# EAGLE design 2layer_v2 (EAGLE 9.4.1)
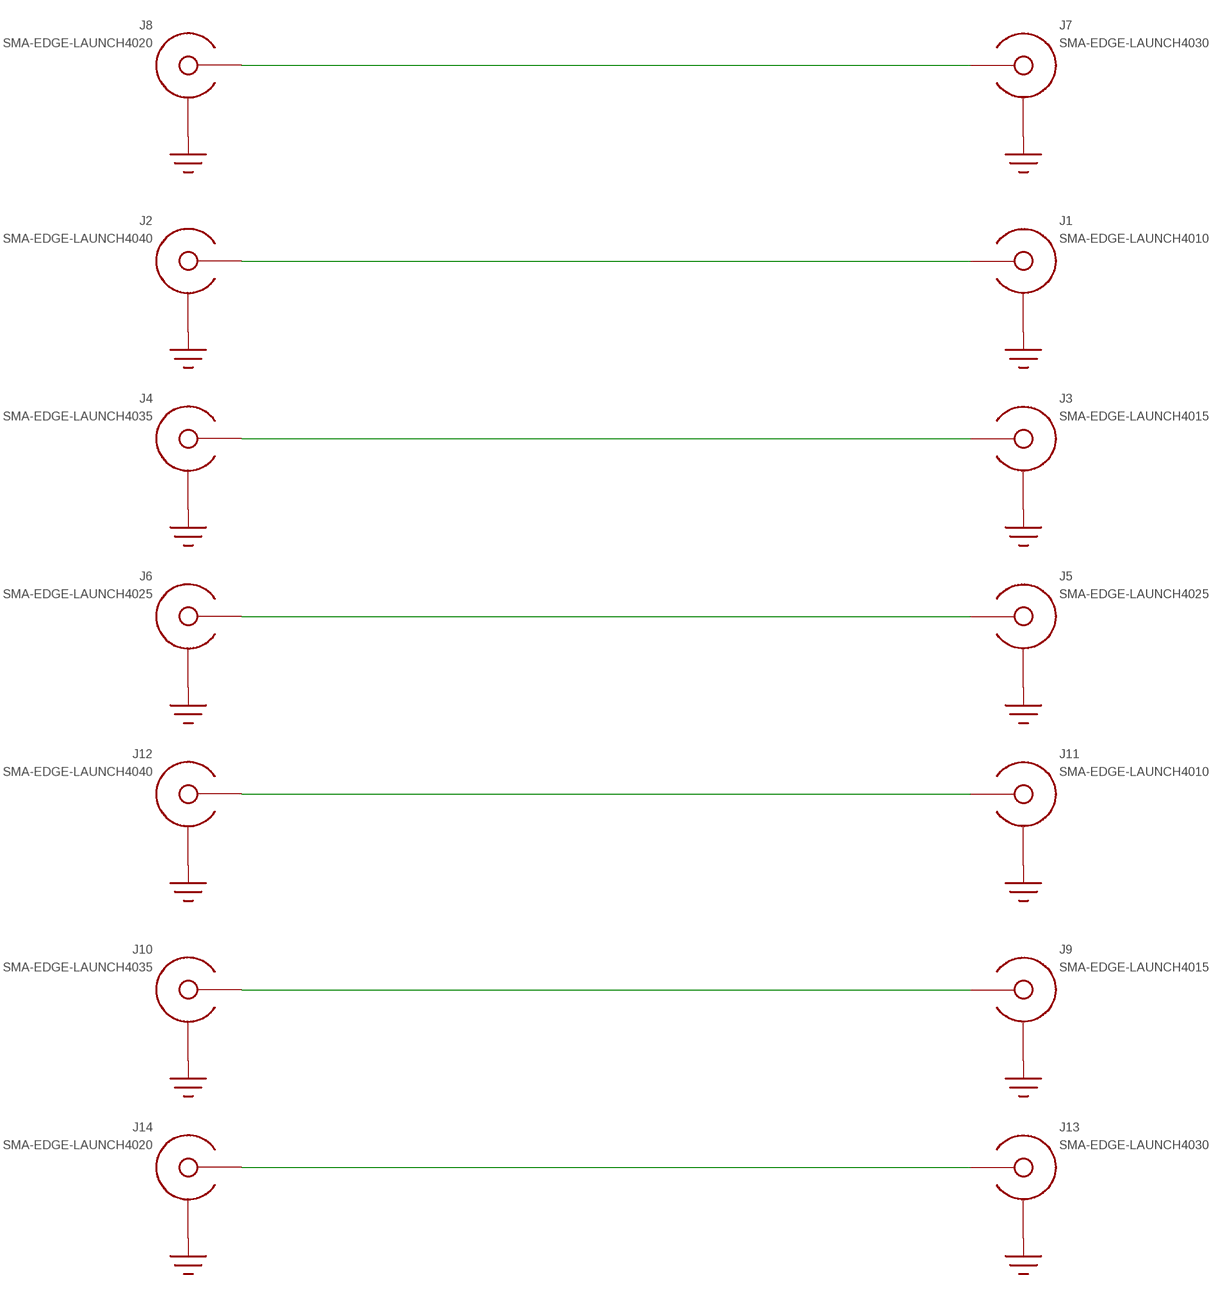
[diagram p0: schematic, sheet 1]

## Parts
J1  SMA-EDGE-LAUNCH4010  [SMA_EDGE_LAUNCH_2L_4010]
J2  SMA-EDGE-LAUNCH4040  [SMA_EDGE_LAUNCH_2L_4040]
J3  SMA-EDGE-LAUNCH4015  [SMA_EDGE_LAUNCH_2L_4015]
J4  SMA-EDGE-LAUNCH4035  [SMA_EDGE_LAUNCH_2L_4035]
J5  SMA-EDGE-LAUNCH4025  [SMA_EDGE_LAUNCH_2L_4025]
J6  SMA-EDGE-LAUNCH4025  [SMA_EDGE_LAUNCH_2L_4025]
J7  SMA-EDGE-LAUNCH4030  [SMA_EDGE_LAUNCH_2L_4030]
J8  SMA-EDGE-LAUNCH4020  [SMA_EDGE_LAUNCH_2L_4020]
J9  SMA-EDGE-LAUNCH4015  [SMA_EDGE_LAUNCH_2L_4015]
J10  SMA-EDGE-LAUNCH4035  [SMA_EDGE_LAUNCH_2L_4035]
J11  SMA-EDGE-LAUNCH4010  [SMA_EDGE_LAUNCH_2L_4010]
J12  SMA-EDGE-LAUNCH4040  [SMA_EDGE_LAUNCH_2L_4040]
J13  SMA-EDGE-LAUNCH4030  [SMA_EDGE_LAUNCH_2L_4030]
J14  SMA-EDGE-LAUNCH4020  [SMA_EDGE_LAUNCH_2L_4020]

## Nets
GND: J1.BOTTOM_GND(SHIELD) J1.GND@1(SHIELD) J1.GND@2(SHIELD) J1.GND@3(SHIELD) J1.GND@4(SHIELD) J1.GND@5(SHIELD) J1.GND@6(SHIELD) J1.GND@7(SHIELD) J1.GND@8(SHIELD) J1.GND@11(SHIELD) J1.GND@12(SHIELD) J1.GND@14(SHIELD) J1.GND@15(SHIELD) J1.GND@16(SHIELD) J1.GND@17(SHIELD) J1.GND_PAD1(SHIELD) J1.GND_PAD2(SHIELD) J2.BOTTOM_GND(SHIELD) J2.GND@1(SHIELD) J2.GND@2(SHIELD) J2.GND@3(SHIELD) J2.GND@4(SHIELD) J2.GND@5(SHIELD) J2.GND@6(SHIELD) J2.GND@7(SHIELD) J2.GND@8(SHIELD) J2.GND@11(SHIELD) J2.GND@12(SHIELD) J2.GND@14(SHIELD) J2.GND@15(SHIELD) J2.GND@16(SHIELD) J2.GND@17(SHIELD) J2.GND_PAD1(SHIELD) J2.GND_PAD2(SHIELD) J3.BOTTOM_GND(SHIELD) J3.GND@1(SHIELD) J3.GND@2(SHIELD) J3.GND@3(SHIELD) J3.GND@4(SHIELD) J3.GND@5(SHIELD) J3.GND@6(SHIELD) J3.GND@7(SHIELD) J3.GND@8(SHIELD) J3.GND@11(SHIELD) J3.GND@12(SHIELD) J3.GND@14(SHIELD) J3.GND@15(SHIELD) J3.GND@16(SHIELD) J3.GND@17(SHIELD) J3.GND_PAD1(SHIELD) J3.GND_PAD2(SHIELD) J4.BOTTOM_GND(SHIELD) J4.GND@1(SHIELD) J4.GND@2(SHIELD) J4.GND@3(SHIELD) J4.GND@4(SHIELD) J4.GND@5(SHIELD) J4.GND@6(SHIELD) J4.GND@7(SHIELD) J4.GND@8(SHIELD) J4.GND@11(SHIELD) J4.GND@12(SHIELD) J4.GND@14(SHIELD) J4.GND@15(SHIELD) J4.GND@16(SHIELD) J4.GND@17(SHIELD) J4.GND_PAD1(SHIELD) J4.GND_PAD2(SHIELD) J5.BOTTOM_GND(SHIELD) J5.GND@1(SHIELD) J5.GND@2(SHIELD) J5.GND@3(SHIELD) J5.GND@4(SHIELD) J5.GND@5(SHIELD) J5.GND@6(SHIELD) J5.GND@7(SHIELD) J5.GND@8(SHIELD) J5.GND@11(SHIELD) J5.GND@12(SHIELD) J5.GND@14(SHIELD) J5.GND@15(SHIELD) J5.GND@16(SHIELD) J5.GND@17(SHIELD) J5.GND_PAD1(SHIELD) J5.GND_PAD2(SHIELD) J6.BOTTOM_GND(SHIELD) J6.GND@1(SHIELD) J6.GND@2(SHIELD) J6.GND@3(SHIELD) J6.GND@4(SHIELD) J6.GND@5(SHIELD) J6.GND@6(SHIELD) J6.GND@7(SHIELD) J6.GND@8(SHIELD) J6.GND@11(SHIELD) J6.GND@12(SHIELD) J6.GND@14(SHIELD) J6.GND@15(SHIELD) J6.GND@16(SHIELD) J6.GND@17(SHIELD) J6.GND_PAD1(SHIELD) J6.GND_PAD2(SHIELD) J7.BOTTOM_GND(SHIELD) J7.GND@1(SHIELD) J7.GND@2(SHIELD) J7.GND@3(SHIELD) J7.GND@4(SHIELD) J7.GND@5(SHIELD) J7.GND@6(SHIELD) J7.GND@7(SHIELD) J7.GND@8(SHIELD) J7.GND@11(SHIELD) J7.GND@12(SHIELD) J7.GND@14(SHIELD) J7.GND@15(SHIELD) J7.GND@16(SHIELD) J7.GND@17(SHIELD) J7.GND_PAD1(SHIELD) J7.GND_PAD2(SHIELD) J8.BOTTOM_GND(SHIELD) J8.GND@1(SHIELD) J8.GND@2(SHIELD) J8.GND@3(SHIELD) J8.GND@4(SHIELD) J8.GND@5(SHIELD) J8.GND@6(SHIELD) J8.GND@7(SHIELD) J8.GND@8(SHIELD) J8.GND@11(SHIELD) J8.GND@12(SHIELD) J8.GND@14(SHIELD) J8.GND@15(SHIELD) J8.GND@16(SHIELD) J8.GND@17(SHIELD) J8.GND_PAD1(SHIELD) J8.GND_PAD2(SHIELD) J9.BOTTOM_GND(SHIELD) J9.GND@1(SHIELD) J9.GND@2(SHIELD) J9.GND@3(SHIELD) J9.GND@4(SHIELD) J9.GND@5(SHIELD) J9.GND@6(SHIELD) J9.GND@7(SHIELD) J9.GND@8(SHIELD) J9.GND@11(SHIELD) J9.GND@12(SHIELD) J9.GND@14(SHIELD) J9.GND@15(SHIELD) J9.GND@16(SHIELD) J9.GND@17(SHIELD) J9.GND_PAD1(SHIELD) J9.GND_PAD2(SHIELD) J10.BOTTOM_GND(SHIELD) J10.GND@1(SHIELD) J10.GND@2(SHIELD) J10.GND@3(SHIELD) J10.GND@4(SHIELD) J10.GND@5(SHIELD) J10.GND@6(SHIELD) J10.GND@7(SHIELD) J10.GND@8(SHIELD) J10.GND@11(SHIELD) J10.GND@12(SHIELD) J10.GND@14(SHIELD) J10.GND@15(SHIELD) J10.GND@16(SHIELD) J10.GND@17(SHIELD) J10.GND_PAD1(SHIELD) J10.GND_PAD2(SHIELD) J11.BOTTOM_GND(SHIELD) J11.GND@1(SHIELD) J11.GND@2(SHIELD) J11.GND@3(SHIELD) J11.GND@4(SHIELD) J11.GND@5(SHIELD) J11.GND@6(SHIELD) J11.GND@7(SHIELD) J11.GND@8(SHIELD) J11.GND@11(SHIELD) J11.GND@12(SHIELD) J11.GND@14(SHIELD) J11.GND@15(SHIELD) J11.GND@16(SHIELD) J11.GND@17(SHIELD) J11.GND_PAD1(SHIELD) J11.GND_PAD2(SHIELD) J12.BOTTOM_GND(SHIELD) J12.GND@1(SHIELD) J12.GND@2(SHIELD) J12.GND@3(SHIELD) J12.GND@4(SHIELD) J12.GND@5(SHIELD) J12.GND@6(SHIELD) J12.GND@7(SHIELD) J12.GND@8(SHIELD) J12.GND@11(SHIELD) J12.GND@12(SHIELD) J12.GND@14(SHIELD) J12.GND@15(SHIELD) J12.GND@16(SHIELD) J12.GND@17(SHIELD) J12.GND_PAD1(SHIELD) J12.GND_PAD2(SHIELD) J13.BOTTOM_GND(SHIELD) J13.GND@1(SHIELD) J13.GND@2(SHIELD) J13.GND@3(SHIELD) J13.GND@4(SHIELD) J13.GND@5(SHIELD) J13.GND@6(SHIELD) J13.GND@7(SHIELD) J13.GND@8(SHIELD) J13.GND@11(SHIELD) J13.GND@12(SHIELD) J13.GND@14(SHIELD) J13.GND@15(SHIELD) J13.GND@16(SHIELD) J13.GND@17(SHIELD) J13.GND_PAD1(SHIELD) J13.GND_PAD2(SHIELD) J14.BOTTOM_GND(SHIELD) J14.GND@1(SHIELD) J14.GND@2(SHIELD) J14.GND@3(SHIELD) J14.GND@4(SHIELD) J14.GND@5(SHIELD) J14.GND@6(SHIELD) J14.GND@7(SHIELD) J14.GND@8(SHIELD) J14.GND@11(SHIELD) J14.GND@12(SHIELD) J14.GND@14(SHIELD) J14.GND@15(SHIELD) J14.GND@16(SHIELD) J14.GND@17(SHIELD) J14.GND_PAD1(SHIELD) J14.GND_PAD2(SHIELD)
N$1 [27-6]: J1.CENTER@1(CENTER) J2.CENTER@1(CENTER)
N$2 [28-6]: J3.CENTER@1(CENTER) J4.CENTER@1(CENTER)
N$3 [30-6]: J5.CENTER@1(CENTER) J6.CENTER@1(CENTER)
N$4 [31-6]: J7.CENTER@1(CENTER) J8.CENTER@1(CENTER)
N$5 [32-6]: J9.CENTER@1(CENTER) J10.CENTER@1(CENTER)
N$6 [33-6]: J11.CENTER@1(CENTER) J12.CENTER@1(CENTER)
N$7 [29-6]: J13.CENTER@1(CENTER) J14.CENTER@1(CENTER)

## Library data of the parts
J1-J14 = sma_footprint_2l:SMA-EDGE-LAUNCH

## Net classes
1 33-6: width 0.838 mm, clearance 0.152 mm
2 32-6: width 0.813 mm, clearance 0.152 mm
3 31-6: width 0.787 mm, clearance 0.152 mm
4 30-6: width 0.762 mm, clearance 0.152 mm
5 29-6: width 0.737 mm, clearance 0.152 mm
6 28-6: width 0.711 mm, clearance 0.152 mm
7 27-6: width 0.686 mm, clearance 0.152 mm

## Board
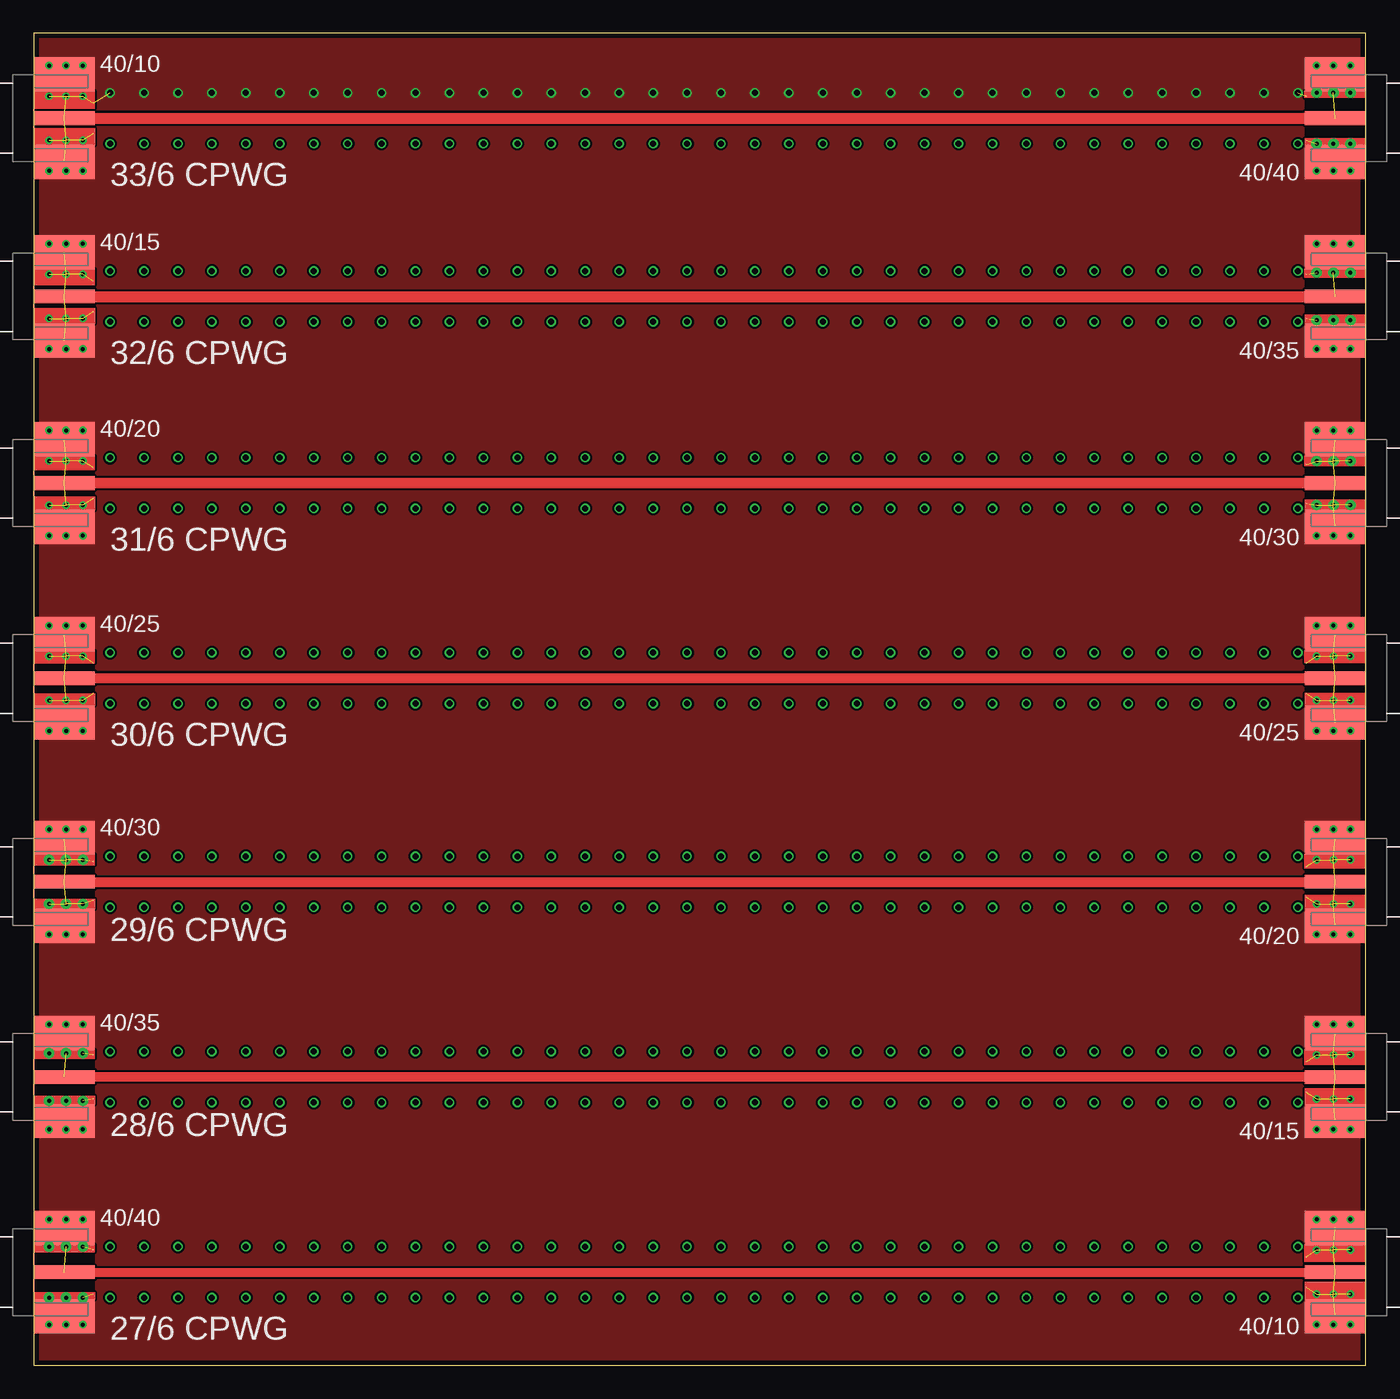
[diagram p1: board, top side]
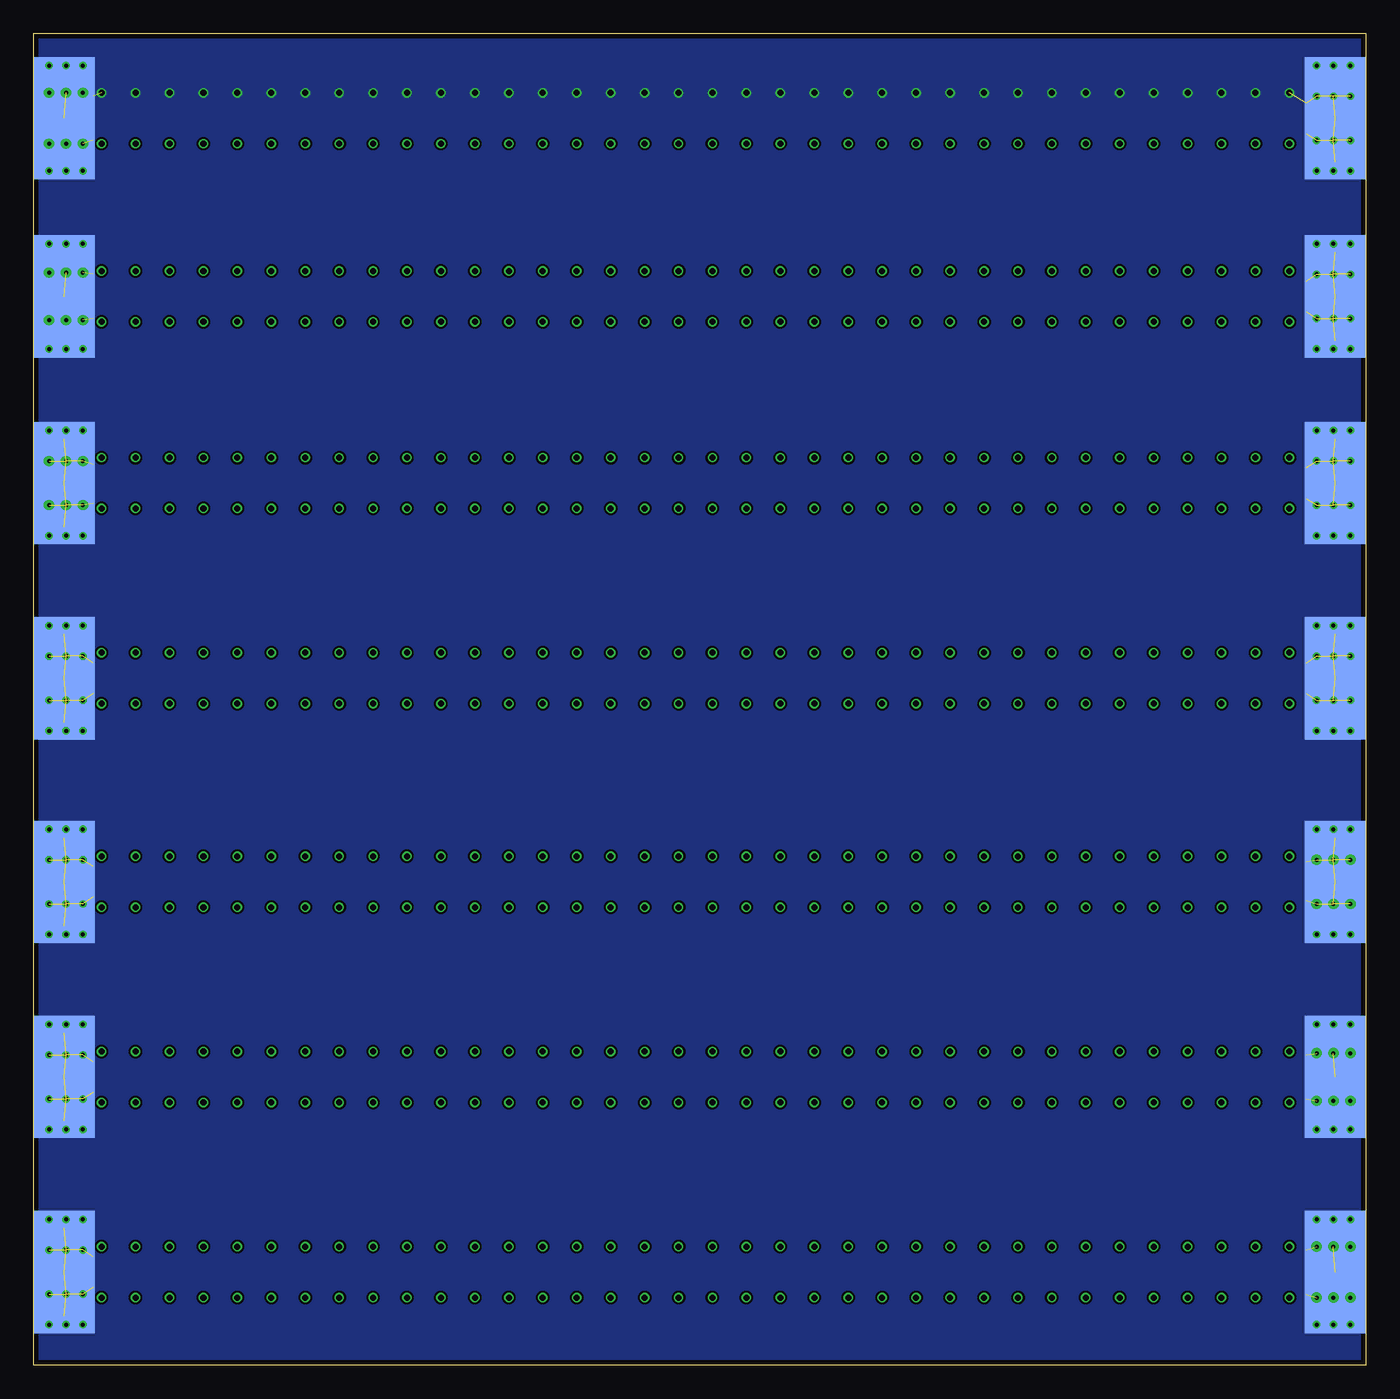
[diagram p2: board, bottom side, seen from below]

Size 99.69 x 99.69 mm. Coordinates in mm from the lower left corner, seen from the top.
Outline: 0,0 99.69,0 99.69,99.69 0,99.69 0,0
Copper layers (1*16): Top 0.035559375mm / dielectric 1.6mm / Bottom 0.035559375mm
Design rules "oshpark-2layer *": minimum track width 6mil, minimum drill 10mil, track to track 6mil, track to pad 6mil, pad to pad 6mil, via to via 6mil, smd to smd 6mil, copper to edge 15mil, drill to drill 6mil, minimum pad ring 5mil, minimum via ring 5mil, stop-mask expansion 2.5mil, vias tented up to drill 20mil, thermal gap 10mil

### Footprints (pad centres in the part's own frame; a part is rotated, then mirrored left to right if it is on the bottom)
SMA_EDGE_LAUNCH_2L_4010 = smd 4.572 x 9.144 bottom: BOTTOM_GND 2.286,0 | smd 4.572 x 1.016: CENTER@1 2.286,0 | drill 0.3: GND@1 1.143,3.937; GND@2 3.683,3.937; GND@3 1.143,1.651; GND@4 3.683,1.651; GND@5 1.143,-1.651; GND@6 3.683,-1.651; GND@7 1.143,-3.937; GND@8 3.683,-3.937; GND@14 2.413,3.937; GND@15 2.413,-3.937; GND@16 2.413,-1.651; GND@17 2.413,1.651 | smd 0.051 x 0.051: GND@11 4.445,1.143; GND@12 4.445,-1.143 | smd 4.572 x 2.54: GND_PAD1 2.286,3.302; GND_PAD2 2.286,-3.302
SMA_EDGE_LAUNCH_2L_4040 = smd 4.572 x 9.144 bottom: BOTTOM_GND 2.286,0 | smd 4.572 x 1.016: CENTER@1 2.286,0 | drill 0.3: GND@1 1.143,3.937; GND@2 3.683,3.937; GND@7 1.143,-3.937; GND@8 3.683,-3.937; GND@14 2.413,3.937; GND@15 2.413,-3.937 | drill 0.3 pad 0.762: GND@3 1.143,1.905; GND@4 3.683,1.905; GND@5 1.143,-1.905; GND@6 3.683,-1.905; GND@16 2.413,-1.905; GND@17 2.413,1.905 | smd 0.051 x 0.051: GND@11 4.445,1.651; GND@12 4.445,-1.651 | smd 4.572 x 2.54: GND_PAD1 2.286,3.302; GND_PAD2 2.286,-3.302
SMA_EDGE_LAUNCH_2L_4015 = smd 4.572 x 9.144 bottom: BOTTOM_GND 2.286,0 | smd 4.572 x 1.016: CENTER@1 2.286,0 | drill 0.3: GND@1 1.143,3.937; GND@2 3.683,3.937; GND@3 1.143,1.651; GND@4 3.683,1.651; GND@5 1.143,-1.651; GND@6 3.683,-1.651; GND@7 1.143,-3.937; GND@8 3.683,-3.937; GND@14 2.413,3.937; GND@15 2.413,-3.937; GND@16 2.413,-1.651; GND@17 2.413,1.651 | smd 0.051 x 0.051: GND@11 4.445,1.143; GND@12 4.445,-1.143 | smd 4.572 x 2.54: GND_PAD1 2.286,3.302; GND_PAD2 2.286,-3.302
SMA_EDGE_LAUNCH_2L_4035 = smd 4.572 x 9.144 bottom: BOTTOM_GND 2.286,0 | smd 4.572 x 1.016: CENTER@1 2.286,0 | drill 0.3: GND@1 1.143,3.937; GND@2 3.683,3.937; GND@7 1.143,-3.937; GND@8 3.683,-3.937; GND@14 2.413,3.937; GND@15 2.413,-3.937 | drill 0.3 pad 0.762: GND@3 1.143,1.778; GND@4 3.683,1.778; GND@5 1.143,-1.778; GND@6 3.683,-1.778; GND@16 2.413,-1.778; GND@17 2.413,1.778 | smd 0.051 x 0.051: GND@11 4.445,1.651; GND@12 4.445,-1.651 | smd 4.572 x 2.54: GND_PAD1 2.286,3.302; GND_PAD2 2.286,-3.302
SMA_EDGE_LAUNCH_2L_4025 = smd 4.572 x 9.144 bottom: BOTTOM_GND 2.286,0 | smd 4.572 x 1.016: CENTER@1 2.286,0 | drill 0.3: GND@1 1.143,3.937; GND@2 3.683,3.937; GND@3 1.143,1.651; GND@4 3.683,1.651; GND@5 1.143,-1.651; GND@6 3.683,-1.651; GND@7 1.143,-3.937; GND@8 3.683,-3.937; GND@14 2.413,3.937; GND@15 2.413,-3.937; GND@16 2.413,-1.651; GND@17 2.413,1.651 | smd 0.051 x 0.051: GND@11 4.445,1.143; GND@12 4.445,-1.143 | smd 4.572 x 2.54: GND_PAD1 2.286,3.302; GND_PAD2 2.286,-3.302
SMA_EDGE_LAUNCH_2L_4030 = smd 4.572 x 9.144 bottom: BOTTOM_GND 2.286,0 | smd 4.572 x 1.016: CENTER@1 2.286,0 | drill 0.3: GND@1 1.143,3.937; GND@2 3.683,3.937; GND@7 1.143,-3.937; GND@8 3.683,-3.937; GND@14 2.413,3.937; GND@15 2.413,-3.937 | drill 0.3 pad 0.762: GND@3 1.143,1.651; GND@4 3.683,1.651; GND@5 1.143,-1.651; GND@6 3.683,-1.651; GND@16 2.413,-1.651; GND@17 2.413,1.651 | smd 0.051 x 0.051: GND@11 4.445,1.524; GND@12 4.445,-1.397 | smd 4.572 x 2.54: GND_PAD1 2.286,3.302; GND_PAD2 2.286,-3.302
SMA_EDGE_LAUNCH_2L_4020 = smd 4.572 x 9.144 bottom: BOTTOM_GND 2.286,0 | smd 4.572 x 1.016: CENTER@1 2.286,0 | drill 0.3: GND@1 1.143,3.937; GND@2 3.683,3.937; GND@3 1.143,1.651; GND@4 3.683,1.651; GND@5 1.143,-1.651; GND@6 3.683,-1.651; GND@7 1.143,-3.937; GND@8 3.683,-3.937; GND@14 2.413,3.937; GND@15 2.413,-3.937; GND@16 2.413,-1.651; GND@17 2.413,1.651 | smd 0.051 x 0.051: GND@11 4.445,1.143; GND@12 4.445,-1.143 | smd 4.572 x 2.54: GND_PAD1 2.286,3.302; GND_PAD2 2.286,-3.302

### Placement (x,y rotation side)
J1  99.69,6.99 180 top
J2  0,6.99 0 top
J3  99.69,21.59 180 top
J4  0,21.59 0 top
J5  99.69,51.44 180 top
J6  0,51.44 0 top
J7  99.69,66.04 180 top
J8  0,66.04 0 top
J9  0,80.01 0 top
J10  99.69,80.01 180 top
J11  0,93.34 0 top
J12  99.69,93.34 180 top
J13  0,36.2 0 top
J14  99.69,36.2 180 top

### Tracks (layer width: path | path; a pad name or v marks a point on that pad's centre or on a via)
GND  (via drill 0.45)  (109 unrouted)
  other vias: 5.71,95.25 8.26,95.25 10.79,95.25 13.34,95.25 15.88,95.25 18.41,95.25 20.95,95.25 23.5,95.25 26.04,95.25 28.57,95.25 31.11,95.25 33.66,95.25 36.2,95.25 38.73,95.25 41.27,95.25 43.81,95.25 46.35,95.25 48.9,95.25 51.44,95.25 53.98,95.25 56.52,95.25 59.05,95.25 61.59,95.25 64.14,95.25 66.67,95.25 69.22,95.25 71.75,95.25 74.3,95.25 76.83,95.25 79.38,95.25 81.92,95.25 84.45,95.25 87,95.25 89.53,95.25 92.08,95.25 94.61,95.25
  pour Top (no thermals): 0,0 99.69,0 99.69,99.69 0,99.69
  pour Bottom (no thermals): 0,0 99.69,0 99.69,99.69 0,99.69
GND1  (via drill 0.45)
  other vias: 5.71,91.44 8.26,91.44 10.79,91.44 13.34,91.44 15.88,91.44 18.41,91.44 20.95,91.44 23.5,91.44 26.04,91.44 28.57,91.44 31.11,91.44 33.66,91.44 36.2,91.44 38.73,91.44 41.27,91.44 43.81,91.44 46.35,91.44 48.9,91.44 51.44,91.44 53.98,91.44 56.52,91.44 59.05,91.44 61.59,91.44 64.14,91.44 66.67,91.44 69.22,91.44 71.75,91.44 74.3,91.44 76.83,91.44 79.38,91.44 81.92,91.44 84.45,91.44 87,91.44 89.53,91.44 92.08,91.44 94.61,91.44
GND2  (via drill 0.45)
  other vias: 5.71,81.92 8.26,81.92 10.79,81.92 13.34,81.92 15.88,81.92 18.41,81.92 20.95,81.92 23.5,81.92 26.04,81.92 28.57,81.92 31.11,81.92 33.66,81.92 36.2,81.92 38.73,81.92 41.27,81.92 43.81,81.92 46.35,81.92 48.9,81.92 51.44,81.92 53.98,81.92 56.52,81.92 59.05,81.92 61.59,81.92 64.14,81.92 66.67,81.92 69.22,81.92 71.75,81.92 74.3,81.92 76.83,81.92 79.38,81.92 81.92,81.92 84.45,81.92 87,81.92 89.53,81.92 92.08,81.92 94.61,81.92
GND3  (via drill 0.45)
  other vias: 5.71,78.11 8.26,78.11 10.79,78.11 13.34,78.11 15.88,78.11 18.41,78.11 20.95,78.11 23.5,78.11 26.04,78.11 28.57,78.11 31.11,78.11 33.66,78.11 36.2,78.11 38.73,78.11 41.27,78.11 43.81,78.11 46.35,78.11 48.9,78.11 51.44,78.11 53.98,78.11 56.52,78.11 59.05,78.11 61.59,78.11 64.14,78.11 66.67,78.11 69.22,78.11 71.75,78.11 74.3,78.11 76.83,78.11 79.38,78.11 81.92,78.11 84.45,78.11 87,78.11 89.53,78.11 92.08,78.11 94.61,78.11
GND4  (via drill 0.45)
  other vias: 5.71,67.94 8.26,67.94 10.79,67.94 13.34,67.94 15.88,67.94 18.41,67.94 20.95,67.94 23.5,67.94 26.04,67.94 28.57,67.94 31.11,67.94 33.66,67.94 36.2,67.94 38.73,67.94 41.27,67.94 43.81,67.94 46.35,67.94 48.9,67.94 51.44,67.94 53.98,67.94 56.52,67.94 59.05,67.94 61.59,67.94 64.14,67.94 66.67,67.94 69.22,67.94 71.75,67.94 74.3,67.94 76.83,67.94 79.38,67.94 81.92,67.94 84.45,67.94 87,67.94 89.53,67.94 92.08,67.94 94.61,67.94
GND5  (via drill 0.45)
  other vias: 5.71,64.14 8.26,64.14 10.79,64.14 13.34,64.14 15.88,64.14 18.41,64.14 20.95,64.14 23.5,64.14 26.04,64.14 28.57,64.14 31.11,64.14 33.66,64.14 36.2,64.14 38.73,64.14 41.27,64.14 43.81,64.14 46.35,64.14 48.9,64.14 51.44,64.14 53.98,64.14 56.52,64.14 59.05,64.14 61.59,64.14 64.14,64.14 66.67,64.14 69.22,64.14 71.75,64.14 74.3,64.14 76.83,64.14 79.38,64.14 81.92,64.14 84.45,64.14 87,64.14 89.53,64.14 92.08,64.14 94.61,64.14
GND6  (via drill 0.45)
  other vias: 5.71,53.34 8.26,53.34 10.79,53.34 13.34,53.34 15.88,53.34 18.41,53.34 20.95,53.34 23.5,53.34 26.04,53.34 28.57,53.34 31.11,53.34 33.66,53.34 36.2,53.34 38.73,53.34 41.27,53.34 43.81,53.34 46.35,53.34 48.9,53.34 51.44,53.34 53.98,53.34 56.52,53.34 59.05,53.34 61.59,53.34 64.14,53.34 66.67,53.34 69.22,53.34 71.75,53.34 74.3,53.34 76.83,53.34 79.38,53.34 81.92,53.34 84.45,53.34 87,53.34 89.53,53.34 92.08,53.34 94.61,53.34
GND7  (via drill 0.45)
  other vias: 5.71,49.53 8.26,49.53 10.79,49.53 13.34,49.53 15.88,49.53 18.41,49.53 20.95,49.53 23.5,49.53 26.04,49.53 28.57,49.53 31.11,49.53 33.66,49.53 36.2,49.53 38.73,49.53 41.27,49.53 43.81,49.53 46.35,49.53 48.9,49.53 51.44,49.53 53.98,49.53 56.52,49.53 59.05,49.53 61.59,49.53 64.14,49.53 66.67,49.53 69.22,49.53 71.75,49.53 74.3,49.53 76.83,49.53 79.38,49.53 81.92,49.53 84.45,49.53 87,49.53 89.53,49.53 92.08,49.53 94.61,49.53
GND8  (via drill 0.45)
  other vias: 5.71,38.1 8.26,38.1 10.79,38.1 13.34,38.1 15.88,38.1 18.41,38.1 20.95,38.1 23.5,38.1 26.04,38.1 28.57,38.1 31.11,38.1 33.66,38.1 36.2,38.1 38.73,38.1 41.27,38.1 43.81,38.1 46.35,38.1 48.9,38.1 51.44,38.1 53.98,38.1 56.52,38.1 59.05,38.1 61.59,38.1 64.14,38.1 66.67,38.1 69.22,38.1 71.75,38.1 74.3,38.1 76.83,38.1 79.38,38.1 81.92,38.1 84.45,38.1 87,38.1 89.53,38.1 92.08,38.1 94.61,38.1
GND9  (via drill 0.45)
  other vias: 5.71,34.29 8.26,34.29 10.79,34.29 13.34,34.29 15.88,34.29 18.41,34.29 20.95,34.29 23.5,34.29 26.04,34.29 28.57,34.29 31.11,34.29 33.66,34.29 36.2,34.29 38.73,34.29 41.27,34.29 43.81,34.29 46.35,34.29 48.9,34.29 51.44,34.29 53.98,34.29 56.52,34.29 59.05,34.29 61.59,34.29 64.14,34.29 66.67,34.29 69.22,34.29 71.75,34.29 74.3,34.29 76.83,34.29 79.38,34.29 81.92,34.29 84.45,34.29 87,34.29 89.53,34.29 92.08,34.29 94.61,34.29
GND10  (via drill 0.45)
  other vias: 5.71,23.5 8.26,23.5 10.79,23.5 13.34,23.5 15.88,23.5 18.41,23.5 20.95,23.5 23.5,23.5 26.04,23.5 28.57,23.5 31.11,23.5 33.66,23.5 36.2,23.5 38.73,23.5 41.27,23.5 43.81,23.5 46.35,23.5 48.9,23.5 51.44,23.5 53.98,23.5 56.52,23.5 59.05,23.5 61.59,23.5 64.14,23.5 66.67,23.5 69.22,23.5 71.75,23.5 74.3,23.5 76.83,23.5 79.38,23.5 81.92,23.5 84.45,23.5 87,23.5 89.53,23.5 92.08,23.5 94.61,23.5
GND11  (via drill 0.45)
  other vias: 5.71,19.68 8.26,19.68 10.79,19.68 13.34,19.68 15.88,19.68 18.41,19.68 20.95,19.68 23.5,19.68 26.04,19.68 28.57,19.68 31.11,19.68 33.66,19.68 36.2,19.68 38.73,19.68 41.27,19.68 43.81,19.68 46.35,19.68 48.9,19.68 51.44,19.68 53.98,19.68 56.52,19.68 59.05,19.68 61.59,19.68 64.14,19.68 66.67,19.68 69.22,19.68 71.75,19.68 74.3,19.68 76.83,19.68 79.38,19.68 81.92,19.68 84.45,19.68 87,19.68 89.53,19.68 92.08,19.68 94.61,19.68
GND12  (via drill 0.45)
  other vias: 5.71,8.89 8.26,8.89 10.79,8.89 13.34,8.89 15.88,8.89 18.41,8.89 20.95,8.89 23.5,8.89 26.04,8.89 28.57,8.89 31.11,8.89 33.66,8.89 36.2,8.89 38.73,8.89 41.27,8.89 43.81,8.89 46.35,8.89 48.9,8.89 51.44,8.89 53.98,8.89 56.52,8.89 59.05,8.89 61.59,8.89 64.14,8.89 66.67,8.89 69.22,8.89 71.75,8.89 74.3,8.89 76.83,8.89 79.38,8.89 81.92,8.89 84.45,8.89 87,8.89 89.53,8.89 92.08,8.89 94.61,8.89
GND13  (via drill 0.45)
  other vias: 5.71,5.08 8.26,5.08 10.79,5.08 13.34,5.08 15.88,5.08 18.41,5.08 20.95,5.08 23.5,5.08 26.04,5.08 28.57,5.08 31.11,5.08 33.66,5.08 36.2,5.08 38.73,5.08 41.27,5.08 43.81,5.08 46.35,5.08 48.9,5.08 51.44,5.08 53.98,5.08 56.52,5.08 59.05,5.08 61.59,5.08 64.14,5.08 66.67,5.08 69.22,5.08 71.75,5.08 74.3,5.08 76.83,5.08 79.38,5.08 81.92,5.08 84.45,5.08 87,5.08 89.53,5.08 92.08,5.08 94.61,5.08
N$1
  Top 0.686: J2.CENTER@1 J1.CENTER@1
N$2
  Top 0.711: J4.CENTER@1 J3.CENTER@1
N$3
  Top 0.762: J6.CENTER@1 J5.CENTER@1
N$4
  Top 0.787: J8.CENTER@1 J7.CENTER@1
N$5
  Top 0.813: J9.CENTER@1 J10.CENTER@1
N$6
  Top 0.838: J11.CENTER@1 J12.CENTER@1
N$7
  Top 0.737: J13.CENTER@1 J14.CENTER@1

### Text on the board
tPlace: 33/6 CPWG | 32/6 CPWG | 31/6 CPWG | 30/6 CPWG | 29/6 CPWG | 28/6 CPWG | 27/6 CPWG